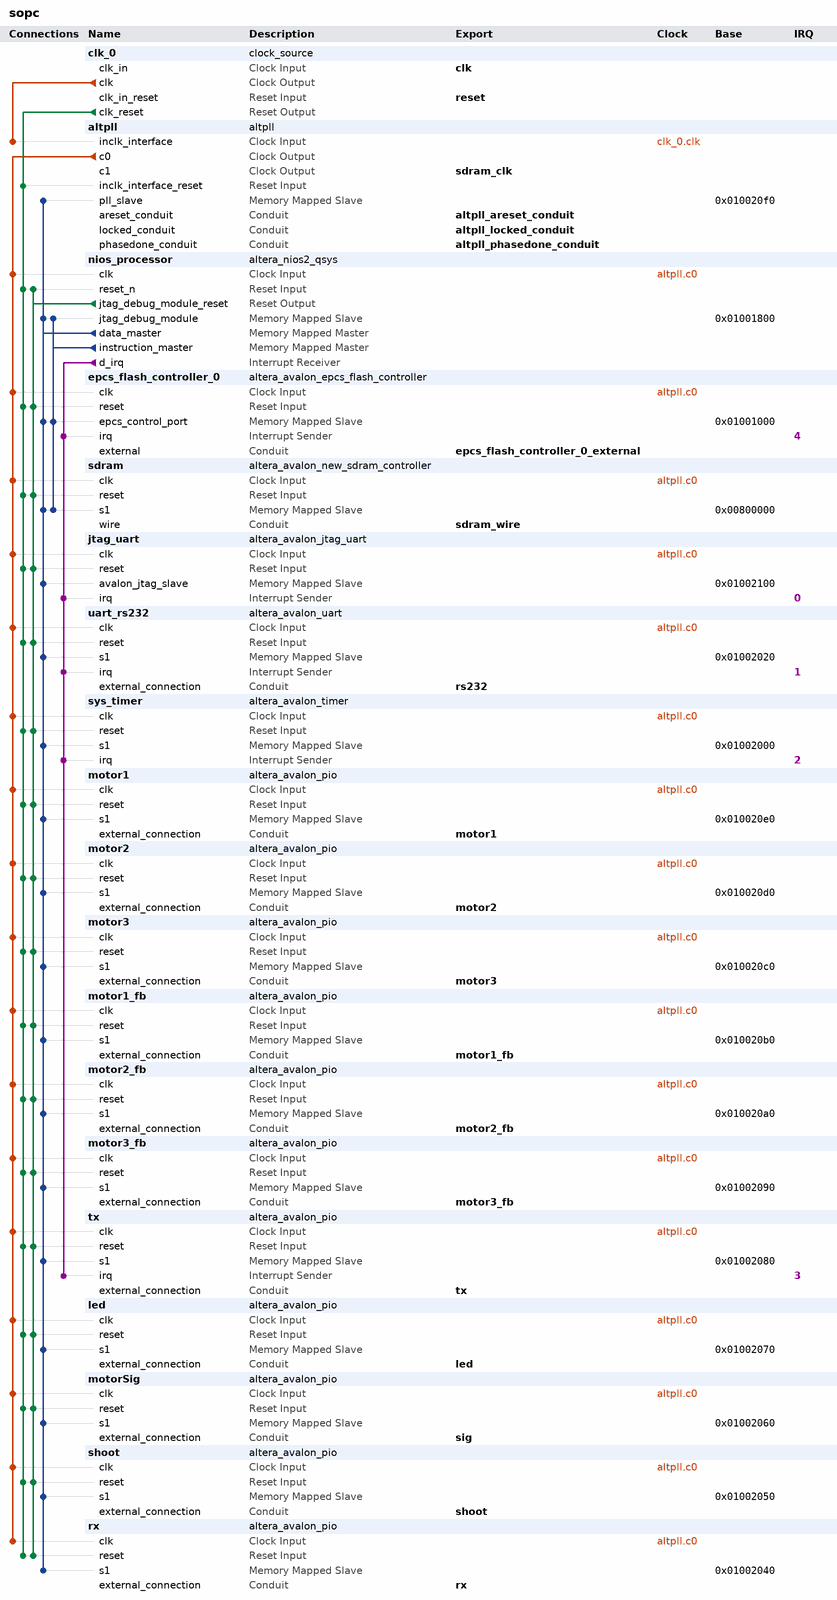
[diagram p0: system contents]
# Platform Designer (Qsys) system sopc, Cyclone IV E EP4CE22F17C6
# Parameters at their usual value, and those the tool derives, are not listed.
package require -exact qsys 13.0.1.99.2
create_system sopc
set_project_property DEVICE_FAMILY {Cyclone IV E}
set_project_property DEVICE EP4CE22F17C6

add_instance clk_0 clock_source 13.0
set_instance_parameter_value clk_0 clockFrequency 50000000

add_instance altpll altpll 13.0
set_instance_parameter_value altpll INCLK0_INPUT_FREQUENCY 20000
set_instance_parameter_value altpll CLK0_MULTIPLY_BY 2
set_instance_parameter_value altpll CLK1_MULTIPLY_BY 2
set_instance_parameter_value altpll CLK0_DIVIDE_BY 1
set_instance_parameter_value altpll CLK1_DIVIDE_BY 1
set_instance_parameter_value altpll CLK1_PHASE_SHIFT -2500
set_instance_parameter_value altpll CLK1_DUTY_CYCLE 50
set_instance_parameter_value altpll PORT_clk1 PORT_USED
set_instance_parameter_value altpll PORT_clk2 PORT_UNUSED
set_instance_parameter_value altpll PORT_clk3 PORT_UNUSED
set_instance_parameter_value altpll PORT_ARESET PORT_UNUSED
set_instance_parameter_value altpll PORT_LOCKED PORT_UNUSED

add_instance nios_processor altera_nios2_qsys 13.0
set_instance_parameter_value nios_processor resetSlave epcs_flash_controller_0.epcs_control_port
set_instance_parameter_value nios_processor mmu_TLBMissExcSlave None
set_instance_parameter_value nios_processor exceptionSlave sdram.s1
set_instance_parameter_value nios_processor breakSlave nios_processor.jtag_debug_module
set_instance_parameter_value nios_processor impl Tiny
set_instance_parameter_value nios_processor icache_size 4096

add_instance epcs_flash_controller_0 altera_avalon_epcs_flash_controller 13.0.1.99.2

add_instance sdram altera_avalon_new_sdram_controller 13.0.1.99.2
set_instance_parameter_value sdram TAC 5.5
set_instance_parameter_value sdram TRCD 20.0
set_instance_parameter_value sdram TRP 20.0
set_instance_parameter_value sdram casLatency 3
set_instance_parameter_value sdram columnWidth 8
set_instance_parameter_value sdram dataWidth 16
set_instance_parameter_value sdram generateSimulationModel false
set_instance_parameter_value sdram model single_Micron_MT48LC4M32B2_7_chip
set_instance_parameter_value sdram numberOfBanks 4
set_instance_parameter_value sdram numberOfChipSelects 1
set_instance_parameter_value sdram powerUpDelay 200.0
set_instance_parameter_value sdram refreshPeriod 7.8125
set_instance_parameter_value sdram rowWidth 12

add_instance jtag_uart altera_avalon_jtag_uart 13.0.1.99.2
set_instance_parameter_value jtag_uart simInteractiveOptions NO_INTERACTIVE_WINDOWS

add_instance uart_rs232 altera_avalon_uart 13.0.1.99.2
set_instance_parameter_value uart_rs232 baud 115200
set_instance_parameter_value uart_rs232 dataBits 8
set_instance_parameter_value uart_rs232 fixedBaud true
set_instance_parameter_value uart_rs232 parity NONE
set_instance_parameter_value uart_rs232 stopBits 1

add_instance sys_timer altera_avalon_timer 13.0.1.99.2
set_instance_parameter_value sys_timer period 1
set_instance_parameter_value sys_timer periodUnits USEC

add_instance motor1 altera_avalon_pio 13.0.1.99.2
set_instance_parameter_value motor1 direction Output
set_instance_parameter_value motor1 width 16

add_instance motor2 altera_avalon_pio 13.0.1.99.2
set_instance_parameter_value motor2 direction Output
set_instance_parameter_value motor2 width 16

add_instance motor3 altera_avalon_pio 13.0.1.99.2
set_instance_parameter_value motor3 direction Output
set_instance_parameter_value motor3 width 16

add_instance motor1_fb altera_avalon_pio 13.0.1.99.2
set_instance_parameter_value motor1_fb direction Input
set_instance_parameter_value motor1_fb width 32

add_instance motor2_fb altera_avalon_pio 13.0.1.99.2
set_instance_parameter_value motor2_fb direction Input
set_instance_parameter_value motor2_fb width 32

add_instance motor3_fb altera_avalon_pio 13.0.1.99.2
set_instance_parameter_value motor3_fb direction Input
set_instance_parameter_value motor3_fb width 32

add_instance tx altera_avalon_pio 13.0.1.99.2
set_instance_parameter_value tx captureEdge true
set_instance_parameter_value tx direction Input
set_instance_parameter_value tx generateIRQ true
set_instance_parameter_value tx irqType EDGE
set_instance_parameter_value tx width 1

add_instance led altera_avalon_pio 13.0.1.99.2
set_instance_parameter_value led direction Output
set_instance_parameter_value led width 2

add_instance motorSig altera_avalon_pio 13.0.1.99.2
set_instance_parameter_value motorSig direction Output
set_instance_parameter_value motorSig width 8

add_instance shoot altera_avalon_pio 13.0.1.99.2
set_instance_parameter_value shoot direction Output
set_instance_parameter_value shoot width 8

add_instance rx altera_avalon_pio 13.0.1.99.2
set_instance_parameter_value rx direction Output
set_instance_parameter_value rx width 1

# connections
add_connection altpll.c0 epcs_flash_controller_0.clk clock
add_connection altpll.c0 jtag_uart.clk clock
add_connection altpll.c0 led.clk clock
add_connection altpll.c0 motor1.clk clock
add_connection altpll.c0 motor1_fb.clk clock
add_connection altpll.c0 motor2.clk clock
add_connection altpll.c0 motor2_fb.clk clock
add_connection altpll.c0 motor3.clk clock
add_connection altpll.c0 motor3_fb.clk clock
add_connection altpll.c0 motorSig.clk clock
add_connection altpll.c0 nios_processor.clk clock
add_connection altpll.c0 rx.clk clock
add_connection altpll.c0 sdram.clk clock
add_connection altpll.c0 shoot.clk clock
add_connection altpll.c0 sys_timer.clk clock
add_connection altpll.c0 tx.clk clock
add_connection altpll.c0 uart_rs232.clk clock
add_connection clk_0.clk altpll.inclk_interface clock
add_connection clk_0.clk_reset altpll.inclk_interface_reset reset
add_connection clk_0.clk_reset epcs_flash_controller_0.reset reset
add_connection clk_0.clk_reset jtag_uart.reset reset
add_connection clk_0.clk_reset led.reset reset
add_connection clk_0.clk_reset motor1.reset reset
add_connection clk_0.clk_reset motor1_fb.reset reset
add_connection clk_0.clk_reset motor2.reset reset
add_connection clk_0.clk_reset motor2_fb.reset reset
add_connection clk_0.clk_reset motor3.reset reset
add_connection clk_0.clk_reset motor3_fb.reset reset
add_connection clk_0.clk_reset motorSig.reset reset
add_connection clk_0.clk_reset nios_processor.reset_n reset
add_connection clk_0.clk_reset rx.reset reset
add_connection clk_0.clk_reset sdram.reset reset
add_connection clk_0.clk_reset shoot.reset reset
add_connection clk_0.clk_reset sys_timer.reset reset
add_connection clk_0.clk_reset tx.reset reset
add_connection clk_0.clk_reset uart_rs232.reset reset
add_connection nios_processor.jtag_debug_module_reset epcs_flash_controller_0.reset reset
add_connection nios_processor.jtag_debug_module_reset jtag_uart.reset reset
add_connection nios_processor.jtag_debug_module_reset led.reset reset
add_connection nios_processor.jtag_debug_module_reset motor1.reset reset
add_connection nios_processor.jtag_debug_module_reset motor1_fb.reset reset
add_connection nios_processor.jtag_debug_module_reset motor2.reset reset
add_connection nios_processor.jtag_debug_module_reset motor2_fb.reset reset
add_connection nios_processor.jtag_debug_module_reset motor3.reset reset
add_connection nios_processor.jtag_debug_module_reset motor3_fb.reset reset
add_connection nios_processor.jtag_debug_module_reset motorSig.reset reset
add_connection nios_processor.jtag_debug_module_reset nios_processor.reset_n reset
add_connection nios_processor.jtag_debug_module_reset rx.reset reset
add_connection nios_processor.jtag_debug_module_reset sdram.reset reset
add_connection nios_processor.jtag_debug_module_reset shoot.reset reset
add_connection nios_processor.jtag_debug_module_reset sys_timer.reset reset
add_connection nios_processor.jtag_debug_module_reset tx.reset reset
add_connection nios_processor.jtag_debug_module_reset uart_rs232.reset reset
add_connection nios_processor.data_master altpll.pll_slave avalon
set_connection_parameter_value nios_processor.data_master/altpll.pll_slave baseAddress 0x010020f0
add_connection nios_processor.data_master epcs_flash_controller_0.epcs_control_port avalon
set_connection_parameter_value nios_processor.data_master/epcs_flash_controller_0.epcs_control_port baseAddress 0x01001000
add_connection nios_processor.data_master jtag_uart.avalon_jtag_slave avalon
set_connection_parameter_value nios_processor.data_master/jtag_uart.avalon_jtag_slave baseAddress 0x01002100
add_connection nios_processor.data_master led.s1 avalon
set_connection_parameter_value nios_processor.data_master/led.s1 baseAddress 0x01002070
add_connection nios_processor.data_master motor1.s1 avalon
set_connection_parameter_value nios_processor.data_master/motor1.s1 baseAddress 0x010020e0
add_connection nios_processor.data_master motor1_fb.s1 avalon
set_connection_parameter_value nios_processor.data_master/motor1_fb.s1 baseAddress 0x010020b0
add_connection nios_processor.data_master motor2.s1 avalon
set_connection_parameter_value nios_processor.data_master/motor2.s1 baseAddress 0x010020d0
add_connection nios_processor.data_master motor2_fb.s1 avalon
set_connection_parameter_value nios_processor.data_master/motor2_fb.s1 baseAddress 0x010020a0
add_connection nios_processor.data_master motor3.s1 avalon
set_connection_parameter_value nios_processor.data_master/motor3.s1 baseAddress 0x010020c0
add_connection nios_processor.data_master motor3_fb.s1 avalon
set_connection_parameter_value nios_processor.data_master/motor3_fb.s1 baseAddress 0x01002090
add_connection nios_processor.data_master motorSig.s1 avalon
set_connection_parameter_value nios_processor.data_master/motorSig.s1 baseAddress 0x01002060
add_connection nios_processor.data_master nios_processor.jtag_debug_module avalon
set_connection_parameter_value nios_processor.data_master/nios_processor.jtag_debug_module baseAddress 0x01001800
add_connection nios_processor.data_master rx.s1 avalon
set_connection_parameter_value nios_processor.data_master/rx.s1 baseAddress 0x01002040
add_connection nios_processor.data_master sdram.s1 avalon
set_connection_parameter_value nios_processor.data_master/sdram.s1 baseAddress 0x00800000
add_connection nios_processor.data_master shoot.s1 avalon
set_connection_parameter_value nios_processor.data_master/shoot.s1 baseAddress 0x01002050
add_connection nios_processor.data_master sys_timer.s1 avalon
set_connection_parameter_value nios_processor.data_master/sys_timer.s1 baseAddress 0x01002000
add_connection nios_processor.data_master tx.s1 avalon
set_connection_parameter_value nios_processor.data_master/tx.s1 baseAddress 0x01002080
add_connection nios_processor.data_master uart_rs232.s1 avalon
set_connection_parameter_value nios_processor.data_master/uart_rs232.s1 baseAddress 0x01002020
add_connection nios_processor.instruction_master epcs_flash_controller_0.epcs_control_port avalon
set_connection_parameter_value nios_processor.instruction_master/epcs_flash_controller_0.epcs_control_port baseAddress 0x01001000
add_connection nios_processor.instruction_master nios_processor.jtag_debug_module avalon
set_connection_parameter_value nios_processor.instruction_master/nios_processor.jtag_debug_module baseAddress 0x01001800
add_connection nios_processor.instruction_master sdram.s1 avalon
set_connection_parameter_value nios_processor.instruction_master/sdram.s1 baseAddress 0x00800000
add_connection nios_processor.d_irq epcs_flash_controller_0.irq interrupt
set_connection_parameter_value nios_processor.d_irq/epcs_flash_controller_0.irq irqNumber 4
add_connection nios_processor.d_irq jtag_uart.irq interrupt
set_connection_parameter_value nios_processor.d_irq/jtag_uart.irq irqNumber 0
add_connection nios_processor.d_irq sys_timer.irq interrupt
set_connection_parameter_value nios_processor.d_irq/sys_timer.irq irqNumber 2
add_connection nios_processor.d_irq tx.irq interrupt
set_connection_parameter_value nios_processor.d_irq/tx.irq irqNumber 3
add_connection nios_processor.d_irq uart_rs232.irq interrupt
set_connection_parameter_value nios_processor.d_irq/uart_rs232.irq irqNumber 1

# exported interfaces
add_interface clk clock sink
set_interface_property clk EXPORT_OF clk_0.clk_in
add_interface reset reset sink
set_interface_property reset EXPORT_OF clk_0.clk_in_reset
add_interface altpll_phasedone_conduit conduit end
set_interface_property altpll_phasedone_conduit EXPORT_OF altpll.phasedone_conduit
add_interface altpll_locked_conduit conduit end
set_interface_property altpll_locked_conduit EXPORT_OF altpll.locked_conduit
add_interface altpll_areset_conduit conduit end
set_interface_property altpll_areset_conduit EXPORT_OF altpll.areset_conduit
add_interface sdram_wire conduit end
set_interface_property sdram_wire EXPORT_OF sdram.wire
add_interface motor1 conduit end
set_interface_property motor1 EXPORT_OF motor1.external_connection
add_interface motor2 conduit end
set_interface_property motor2 EXPORT_OF motor2.external_connection
add_interface rs232 conduit end
set_interface_property rs232 EXPORT_OF uart_rs232.external_connection
add_interface motor3 conduit end
set_interface_property motor3 EXPORT_OF motor3.external_connection
add_interface motor1_fb conduit end
set_interface_property motor1_fb EXPORT_OF motor1_fb.external_connection
add_interface motor2_fb conduit end
set_interface_property motor2_fb EXPORT_OF motor2_fb.external_connection
add_interface motor3_fb conduit end
set_interface_property motor3_fb EXPORT_OF motor3_fb.external_connection
add_interface sdram_clk clock source
set_interface_property sdram_clk EXPORT_OF altpll.c1
add_interface tx conduit end
set_interface_property tx EXPORT_OF tx.external_connection
add_interface epcs_flash_controller_0_external conduit end
set_interface_property epcs_flash_controller_0_external EXPORT_OF epcs_flash_controller_0.external
add_interface led conduit end
set_interface_property led EXPORT_OF led.external_connection
add_interface sig conduit end
set_interface_property sig EXPORT_OF motorSig.external_connection
add_interface shoot conduit end
set_interface_property shoot EXPORT_OF shoot.external_connection
add_interface rx conduit end
set_interface_property rx EXPORT_OF rx.external_connection

set_interconnect_requirement {$system} qsys_mm.clockCrossingAdapter HANDSHAKE
set_interconnect_requirement {$system} qsys_mm.maxAdditionalLatency 1

save_system sopc.qsys
